# EAGLE design fixture (EAGLE 6.6.0)
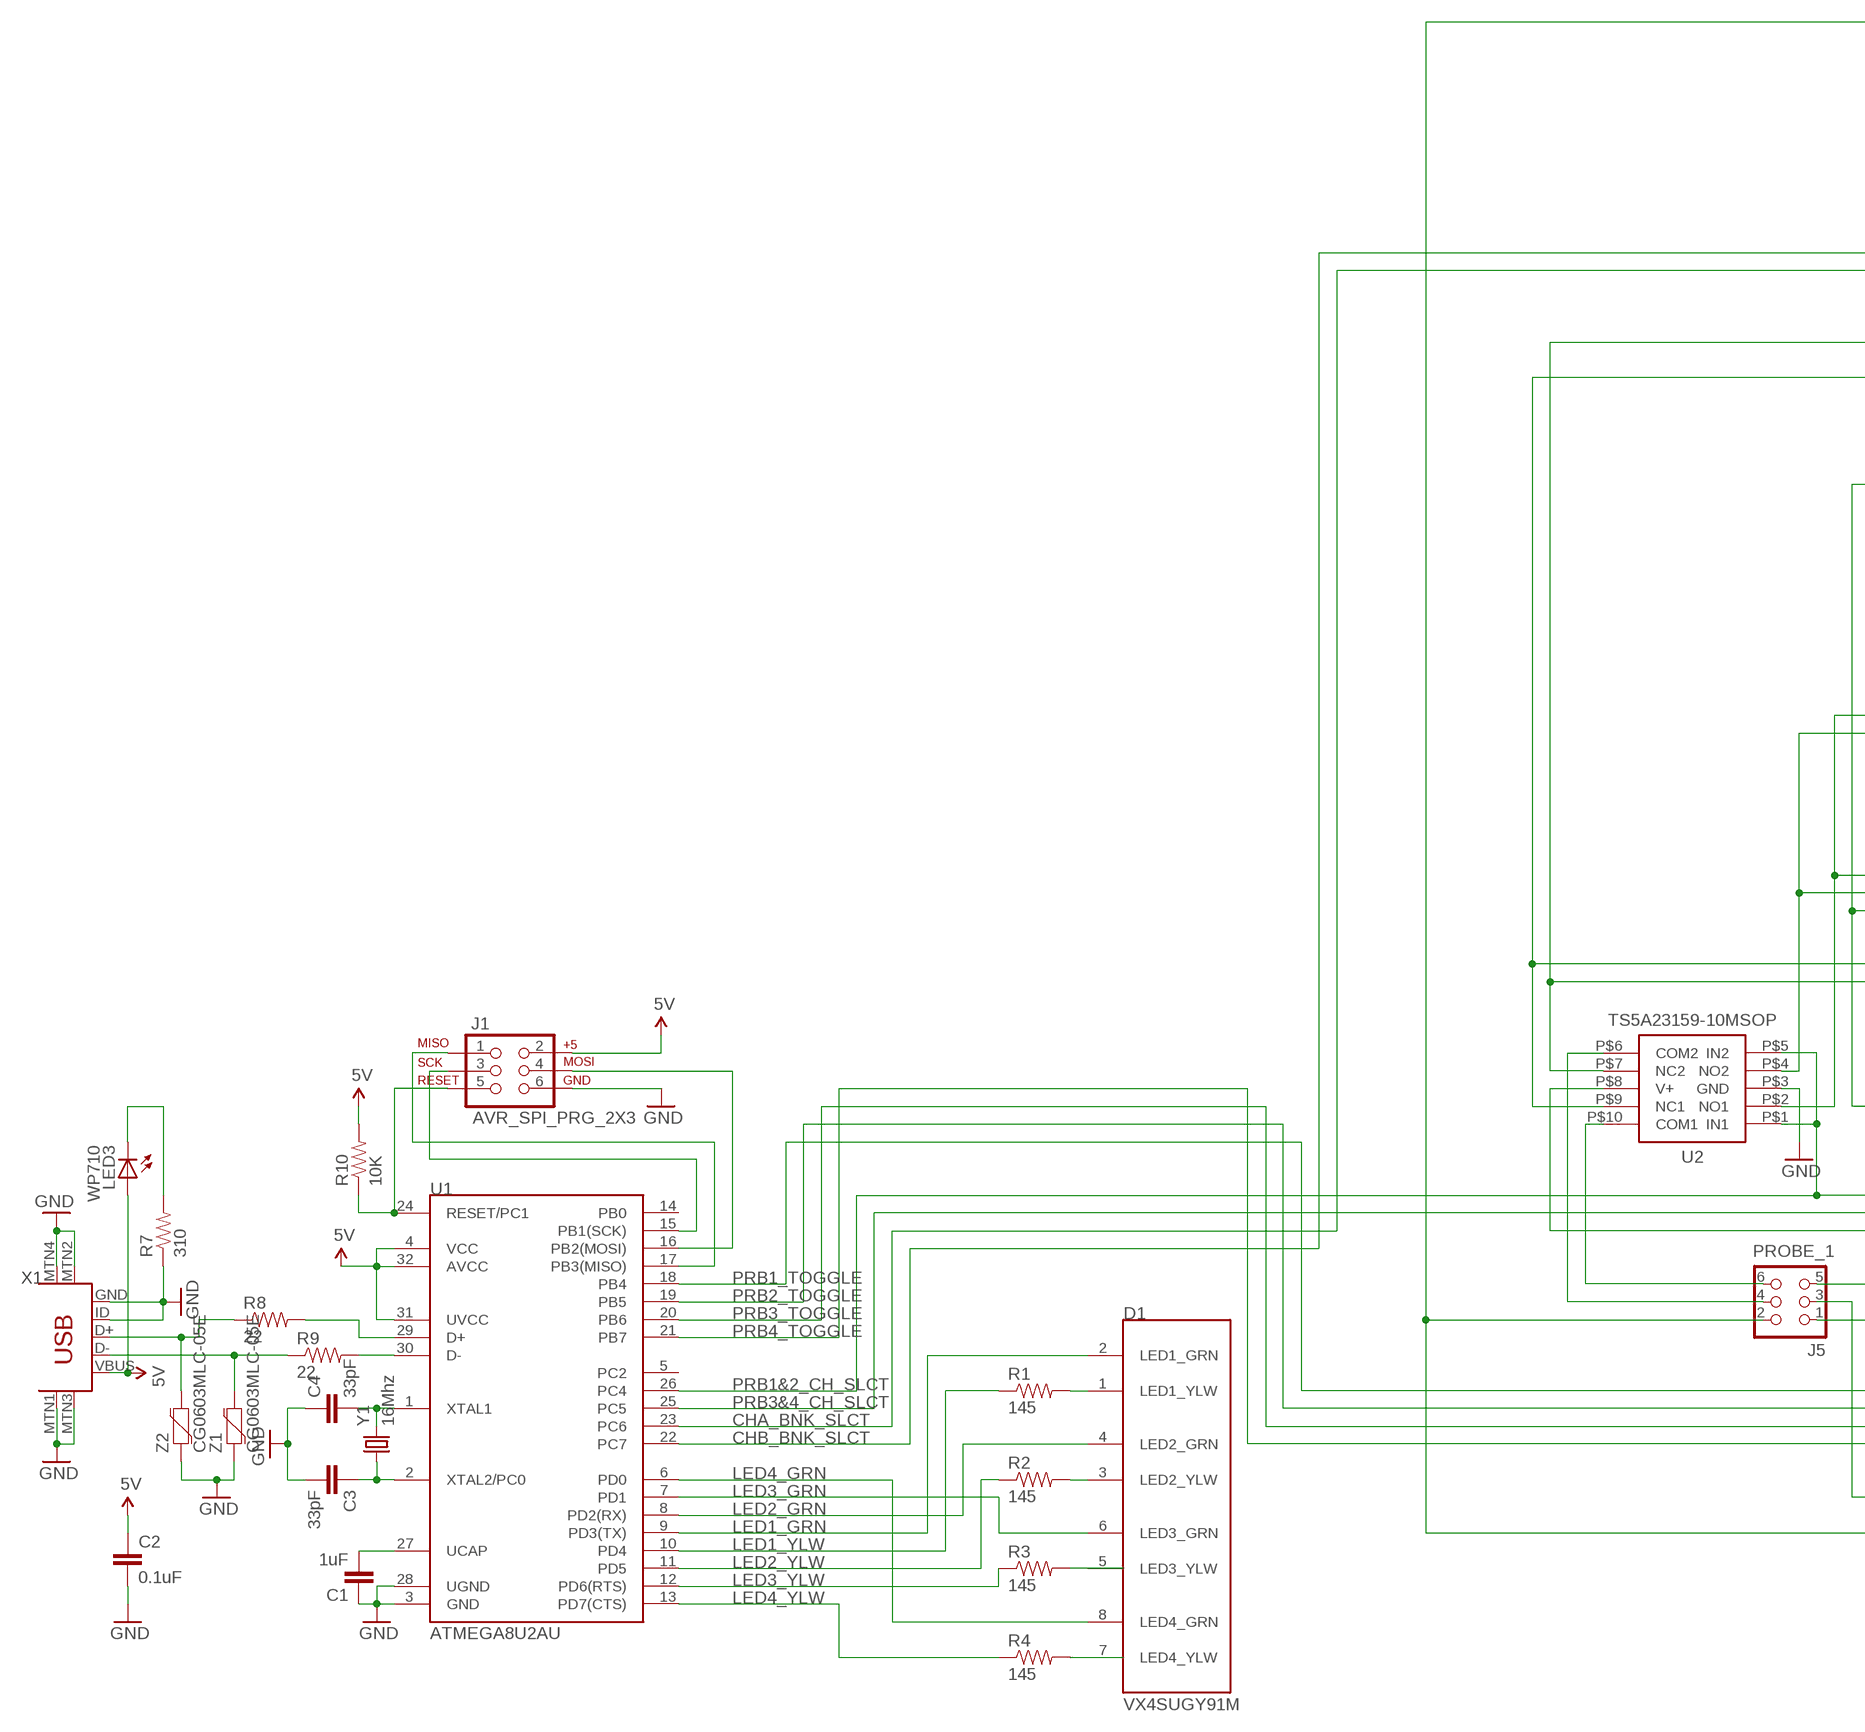
[diagram p0: schematic, sheet 1, part 1 of 2]
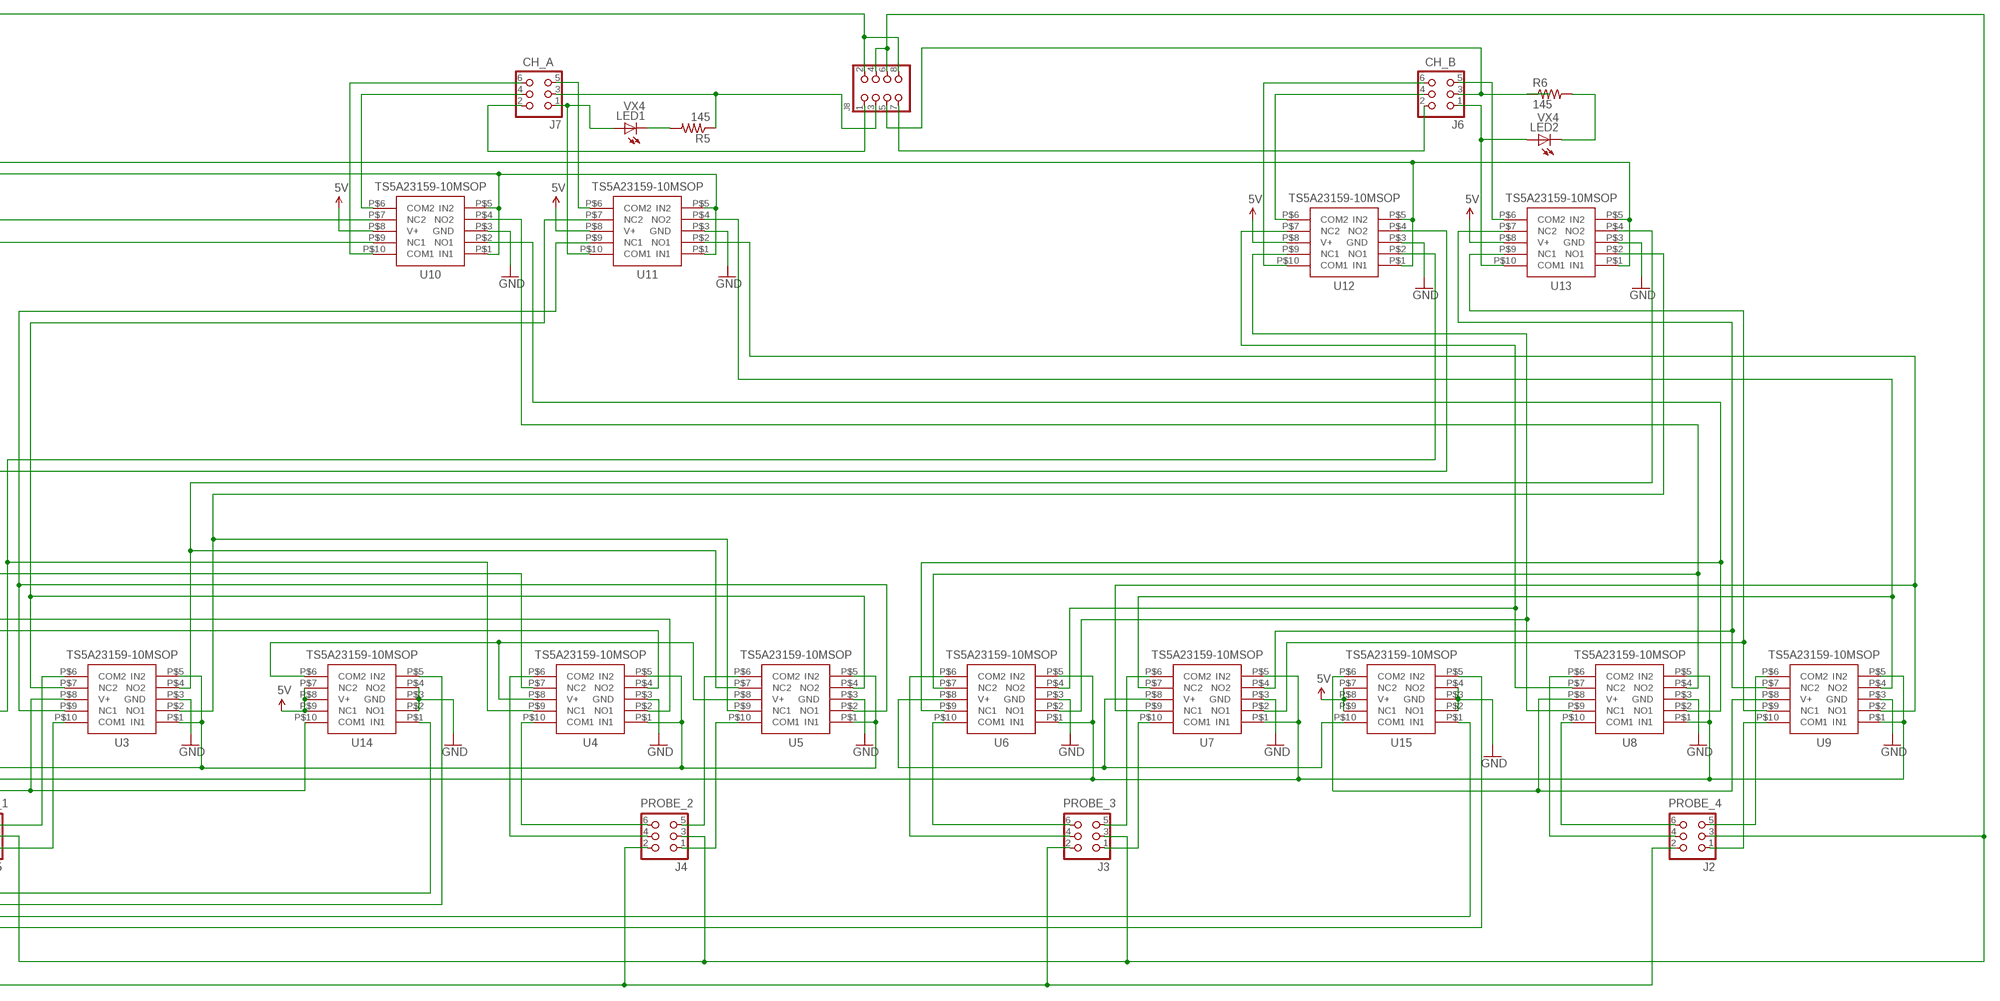
[diagram p1: schematic, sheet 1, part 2 of 2]

## Parts
C1  1uF  1.0UF-16V-10%(0603)  [0603-CAP]
C2  0.1uF  10UF-6.3V-20%(1206)  [1206]
C3  33pF  0.1UF-25V(+80/-20%)(0603)  [0603-CAP]
C4  33pF  0.1UF-25V(+80/-20%)(0603)  [0603-CAP]
D1  VX4SUGY91M  [THRU_HOLE]
J1  AVR_SPI_PRG_2X3  AVR_SPI_PRG_6PTH  [2X3]
J2  CON_HEADER_2X03-PTH  [M2X3]
J3  CON_HEADER_2X03-PTH  [M2X3]
J4  CON_HEADER_2X03-PTH  [M2X3]
J5  CON_HEADER_2X03-PTH  [M2X3]
J6  CON_HEADER_2X03-PTH  [M2X3]
J7  CON_HEADER_2X03-PTH  [M2X3]
J8  CON_HEADER_2X04-PTH  [M2X4]
LED1  VX4  LED3MM  [LED3MM]
LED2  VX4  LED3MM  [LED3MM]
LED3  WP710  LED3MM  [LED3MM]
R1  145  RESISTOR0603-RES  [0603-RES]
R2  145  RESISTOR0603-RES  [0603-RES]
R3  145  RESISTOR0603-RES  [0603-RES]
R4  145  RESISTOR0603-RES  [0603-RES]
R5  145  RESISTOR0603-RES  [0603-RES]
R6  145  RESISTOR0603-RES  [0603-RES]
R7  310  RESISTOR0603-RES  [0603-RES]
R8  22  RESISTOR0603-RES  [0603-RES]
R9  22  RESISTOR0603-RES  [0603-RES]
R10  10K  RESISTOR0603-RES  [0603-RES]
U1  ATMEGA8U2AU  [TQFP32-08]
U2  TS5A23159-10MSOP  [10MSOP]
U3  TS5A23159-10MSOP  [10MSOP]
U4  TS5A23159-10MSOP  [10MSOP]
U5  TS5A23159-10MSOP  [10MSOP]
U6  TS5A23159-10MSOP  [10MSOP]
U7  TS5A23159-10MSOP  [10MSOP]
U8  TS5A23159-10MSOP  [10MSOP]
U9  TS5A23159-10MSOP  [10MSOP]
U10  TS5A23159-10MSOP  [10MSOP]
U11  TS5A23159-10MSOP  [10MSOP]
U12  TS5A23159-10MSOP  [10MSOP]
U13  TS5A23159-10MSOP  [10MSOP]
U14  TS5A23159-10MSOP  [10MSOP]
U15  TS5A23159-10MSOP  [10MSOP]
X1  USB-MINIB-5PIN  [USB-MINIB]
Y1  16Mhz  CRYSTALHC49US  [HC49US]
Z1  CG0603MLC-05E  VARISTOR-0603  [0603-RES]
Z2  CG0603MLC-05E  VARISTOR-0603  [0603-RES]

## Nets
5V: C2.1 J1.2 LED3.A R10.2 U1.4(VCC) U1.31(UVCC) U1.32(AVCC) U10.P$8(V+) U11.P$8(V+) U12.P$8(V+) U13.P$8(V+) U14.P$7(NC2) U14.P$8(V+) U14.P$9(NC1) U15.P$7(NC2) U15.P$8(V+) U15.P$9(NC1) X1.VBUS
BOB123: U3.P$2(NO1) U5.P$9(NC1) U13.P$2(NO1)
CH_A_+5CON: J7.1 LED1.A U11.P$10(COM1)
CH_A_BULK: J7.2 J8.1
CH_A_CLOCK: J7.6 U10.P$10(COM1)
CH_A_DATA: J7.5 U11.P$6(COM2)
CH_A_GND: J7.3 J8.3 R5.1
CH_A_INT: J7.4 U10.P$6(COM2)
CH_B_+5CON: J6.1 LED2.A U13.P$10(COM1)
CH_B_BULK: J6.2 J8.7
CH_B_CLOCK: J6.6 U12.P$10(COM1)
CH_B_DATA: J6.5 U13.P$6(COM2)
CH_B_GND: J6.3 J8.5 R6.1
CH_B_INT: J6.4 U12.P$6(COM2)
CHA_BNK_SLCT: U1.23(PC6) U10.P$1(IN1) U10.P$5(IN2) U11.P$1(IN1) U11.P$5(IN2)
CHB_BNK_SLCT: U1.22(PC7) U12.P$1(IN1) U12.P$5(IN2) U13.P$1(IN1) U13.P$5(IN2)
GND: C1.1 C2.2 C3.2 C4.1 J1.6 R7.1 U1.3(GND) U1.28(UGND) U2.P$3(GND) U3.P$3(GND) U4.P$3(GND) U5.P$3(GND) U6.P$3(GND) U7.P$3(GND) U8.P$3(GND) U9.P$3(GND) U10.P$3(GND) U11.P$3(GND) U12.P$3(GND) U13.P$3(GND) U14.P$2(NO1) U14.P$3(GND) U14.P$4(NO2) U15.P$2(NO1) U15.P$3(GND) U15.P$4(NO2) X1.GND X1.ID X1.MTN1(MTN2) X1.MTN2(MTN3) X1.MTN3(MTN1) X1.MTN4 Z1.1 Z2.1
LED1_GRN: D1.2(LED1_GRN) U1.9(PD3(TX))
LED1_YLW: R1.1 U1.10(PD4)
LED2_GRN: D1.4(LED2_GRN) U1.8(PD2(RX))
LED2_YLW: R2.1 U1.11(PD5)
LED3_GRN: D1.6(LED3_GRN) U1.7(PD1)
LED3_YLW: R3.1 U1.12(PD6(RTS))
LED4_GRN: D1.8(LED4_GRN) U1.6(PD0)
LED4_YLW: R4.1 U1.13(PD7(CTS))
MISO: J1.1 U1.17(PB3(MISO))
MOSI: J1.4 U1.16(PB2(MOSI))
N$1: R8.1 X1.D+ Z2.2
N$2: R8.2 U1.29(D+)
N$3: R9.2 U1.30(D-)
N$4: R9.1 X1.D- Z1.2
N$5: C1.2 U1.27(UCAP)
N$6: U8.P$8(V+) U9.P$8(V+) U15.P$6(COM2)
N$7: C4.2 U1.1(XTAL1) Y1.2
N$8: C3.1 U1.2(XTAL2/PC0) Y1.1
N$9: U6.P$8(V+) U7.P$8(V+) U15.P$10(COM1)
N$10: D1.1(LED1_YLW) R1.2
N$11: D1.3(LED2_YLW) R2.2
N$12: D1.5(LED3_YLW) R3.2
N$13: D1.7(LED4_YLW) R4.2
N$14: U4.P$8(V+) U5.P$8(V+) U14.P$6(COM2)
N$48: LED1.K(C) R5.2
N$49: LED2.K(C) R6.2
N$50: U7.P$2(NO1) U9.P$9(NC1) U13.P$9(NC1)
N$51: U7.P$4(NO2) U9.P$7(NC2) U13.P$7(NC2)
N$52: U6.P$2(NO1) U8.P$9(NC1) U12.P$9(NC1)
N$53: U6.P$4(NO2) U8.P$7(NC2) U12.P$7(NC2)
N$54: U7.P$9(NC1) U9.P$2(NO1) U11.P$2(NO1)
N$55: U7.P$7(NC2) U9.P$4(NO2) U11.P$4(NO2)
N$56: U6.P$9(NC1) U8.P$2(NO1) U10.P$2(NO1)
N$57: U6.P$7(NC2) U8.P$4(NO2) U10.P$4(NO2)
N$58: U3.P$9(NC1) U5.P$2(NO1) U11.P$9(NC1)
N$59: U3.P$7(NC2) U5.P$4(NO2) U11.P$7(NC2)
N$60: U2.P$9(NC1) U4.P$2(NO1) U10.P$9(NC1)
N$61: U2.P$7(NC2) U4.P$4(NO2) U10.P$7(NC2)
N$62: U2.P$4(NO2) U4.P$7(NC2) U12.P$4(NO2)
N$63: U2.P$2(NO1) U4.P$9(NC1) U12.P$2(NO1)
N$64: U3.P$4(NO2) U5.P$7(NC2) U13.P$4(NO2)
N$65: LED3.K(C) R7.2
PRB1&2_CH_SLCT: U1.26(PC4) U2.P$1(IN1) U2.P$5(IN2) U3.P$1(IN1) U3.P$5(IN2) U4.P$1(IN1) U4.P$5(IN2) U5.P$1(IN1) U5.P$5(IN2)
PRB1_TOGGLE: U1.18(PB4) U14.P$1(IN1)
PRB2_TOGGLE: U1.19(PB5) U14.P$5(IN2)
PRB3&4_CH_SLCT: U1.25(PC5) U6.P$1(IN1) U6.P$5(IN2) U7.P$1(IN1) U7.P$5(IN2) U8.P$1(IN1) U8.P$5(IN2) U9.P$1(IN1) U9.P$5(IN2)
PRB3_TOGGLE: U1.20(PB6) U15.P$1(IN1)
PRB4_TOGGLE: U1.21(PB7) U15.P$5(IN2)
PROBE1_+5CON: J5.1 U3.P$10(COM1)
PROBE1_CLOCK: J5.6 U2.P$10(COM1)
PROBE1_DATA: J5.5 U3.P$6(COM2)
PROBE1_INT: J5.4 U2.P$6(COM2)
PROBE1_PWR: U2.P$8(V+) U3.P$8(V+) U14.P$10(COM1)
PROBE2_+5CON: J4.1 U5.P$10(COM1)
PROBE2_CLOCK: J4.6 U4.P$10(COM1)
PROBE2_DATA: J4.5 U5.P$6(COM2)
PROBE2_INT: J4.4 U4.P$6(COM2)
PROBE3_+5CON: J3.1 U7.P$10(COM1)
PROBE3_CLOCK: J3.6 U6.P$10(COM1)
PROBE3_DATA: J3.5 U7.P$6(COM2)
PROBE3_INT: J3.4 U6.P$6(COM2)
PROBE4_+5CON: J2.1 U9.P$10(COM1)
PROBE4_CLOCK: J2.6 U8.P$10(COM1)
PROBE4_DATA: J2.5 U9.P$6(COM2)
PROBE4_INT: J2.4 U8.P$6(COM2)
RESET: J1.5 R10.1 U1.24(RESET/PC1)
SCK: J1.3 U1.15(PB1(SCK))
SCOPE_BULK: J2.2 J3.2 J4.2 J5.2 J8.2 J8.8
SCOPE_GND: J2.3 J3.3 J4.3 J5.3 J8.4 J8.6
Unconnected: U1.5(PC2) U1.14(PB0)

## Notes on the sheet
- CH_A | CH_B
- PROBE_1 | PROBE_2 | PROBE_3 | PROBE_4
- X1

## Library data of the parts
C1 = SparkFun-Capacitors:1.0UF-16V-10%(0603): CAP-00868; PROD_ID: CAP-00868; VALUE: 1.0uF
C2 = SparkFun-Capacitors:10UF-6.3V-20%(1206): CAP-10057 Ceramic; PROD_ID: CAP-10057; VALUE: 10uF
C3 C4 = SparkFun-Capacitors:0.1UF-25V(+80/-20%)(0603): CAP-00810 Ceramic Standard decoupling cap; PROD_ID: CAP-00810; VALUE: 0.1uF
D1 = VX4SUGY91M:VX4SUGY91M: SunLED VX4SUGY91M 2X3mm QUAD-LEVEL LED INDICATOR Green/Yellow bicolor quad LED. Black pastic 8 pin through hole right angle. Pins are active high! datasheet: http://www.jameco.com/Jameco/Products/ProdDS/2125464.pdf
J1 = SparkFun-Connectors:AVR_SPI_PRG_6: AVR ISP 6 Pin This is the reduced ISP connector for AVR programming. Common on Arduino. This footprint will take up less PCB space and can be used with a 10-pin to 6-pin adapter such as SKU: BOB-08508
J2-J7 = 0_DangerousPrototypes:CON_HEADER_2X03
J8 = 0_DangerousPrototypes:CON_HEADER_2X04
LED1-LED3 = led:LED: LED OSRAM: - CHIPLED LG R971, LG N971, LY N971, LG Q971, LY Q971, LO R971, LY R971 LH N974, LH R974 LS Q976, LO Q976, LY Q976 LO Q996 - Hyper CHIPLED LW Q18S LB Q993, LB Q99A, LB R99A - SideLED LS A670, LO A670, LY A670, LG A670, LP A670 LB A673, LV A673, LT A673, LW A673 LH A674 LY A675 LS A676, LA A676, LO A676, LY A676, LW A676 LS A679, LY A679, LG A679 - Hyper Micro SIDELED® LS Y876, LA Y876, LO Y876, LY Y876 LT Y87S - SmartLED LW L88C, LW L88S LB L89C, LB L89S, LG L890 LS L89K, LO L89K, LY L89K LS L896, LA L896, LO L896, LY L896 - TOPLED LS T670, LO T670, LY T670, LG T670, LP T670 LSG T670, LSP T670, LSY T670, LOP T670, LYG T670 LG T671, LOG T671, LSG T671 LB T673, LV T673, LT T673, LW T673 LH T674 LS T676, LA T676, LO T676, LY T676, LB T676, LH T676, LSB T676, LW T676 LB T67C, LV T67C, LT T67C, LS T67K, LO T67K, LY T67K, LW E67C LS E67B, LA E67B, LO E67B, LY E67B, LB E67C, LV E67C, LT E67C LW T67C LS T679, LY T679, LG T679 LS T770, LO T770, LY T770, LG T770, LP T770 LB T773, LV T773, LT T773, LW T773 LH T774 LS E675, LA E675, LY E675, LS T675 LS T776, LA T776, LO T776, LY T776, LB T776 LHGB T686 LT T68C, LB T68C - Hyper Mini TOPLED® LB M676 - Mini TOPLED Santana® LG M470 LS M47K, LO M47K, LY M47K Source: http://www.osram.convergy.de LUXEON: - LUMILED® LXK2-PW12-R00, LXK2-PW12-S00, LXK2-PW14-U00, LXK2-PW14-V00 LXK2-PM12-R00, LXK2-PM12-S00, LXK2-PM14-U00 LXK2-PE12-Q00, LXK2-PE12-R00, LXK2-PE12-S00, LXK2-PE14-T00, LXK2-PE14-U00 LXK2-PB12-K00, LXK2-PB12-L00, LXK2-PB12-M00, LXK2-PB14-N00, LXK2-PB14-P00, LXK2-PB14-Q00 LXK2-PR12-L00, LXK2-PR12-M00, LXK2-PR14-Q00, LXK2-PR14-R00 LXK2-PD12-Q00, LXK2-PD12-R00, LXK2-PD12-S00 LXK2-PH12-R00, LXK2-PH12-S00 LXK2-PL12-P00, LXK2-PL12-Q00, LXK2-PL12-R00 Source: www.luxeon.com KINGBRIGHT: KA-3528ASYC Source: www.kingbright.com
R1-R10 = SparkFun-Passives:RESISTOR: Resistor Basic schematic elements and footprints for 0603, 1206, and PTH resistors.
U1 = SparkFun-DigitalIC:ATMEGA8U2: Atmel 32-pin 8-bit Microcontroller with 8/16/32K Bystes of ISP Flash and USB Controller. ATmega8U2, ATmega16U2, and ATmega32U2
U2-U15 = TS5A23159:TS5A23159: Texas Instruments TS5A23159 Dual SPDT Analog Switch Datasheet: http://www.ti.com/lit/ds/scds201g/scds201g.pdf
X1 = SparkFun-Connectors:USB-MINIB: Mini-USB "B" connector with 5th pin broken out. Created new symbol breaking out 5th "ID" pin in mini/micro USB connector spec. See: http://en.wikipedia.org/wiki/Mini_usb#Cables. Uses same footprint as 4-pin symbol. Also added pins to connect to mounting / shield pads if required (probably not generally needed as signals aren't shielded once they leave the connector).
Y1 = SparkFun-FreqCtrl:CRYSTAL: Various standard crystals. Proven footprints.
Z1 Z2 = SparkFun-DiscreteSemi:VARISTOR: Varistor Varistor (Variable resistor) is a nonlinear resistive element of the voltage dependence that resistance changes with applied voltage. Varistor is equivalent with Zener diode of two series connection.

## Board
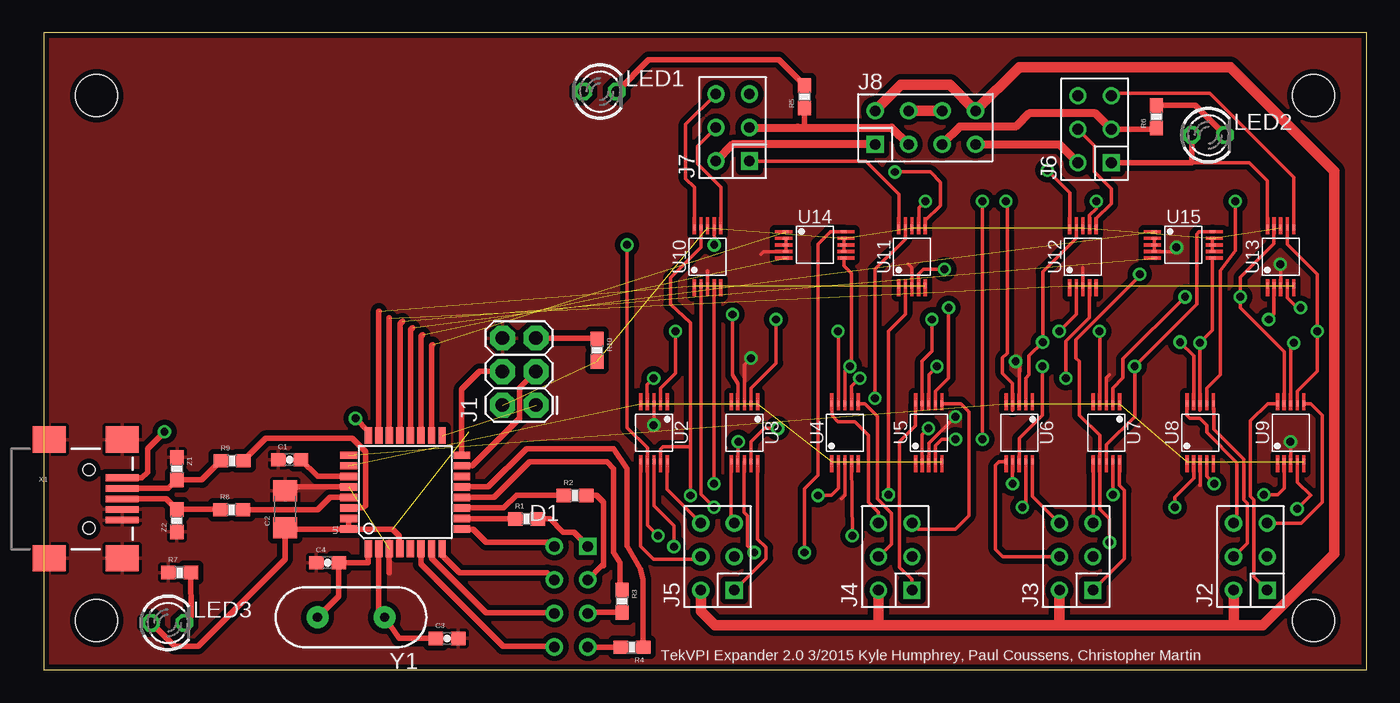
[diagram p2: board, top side]
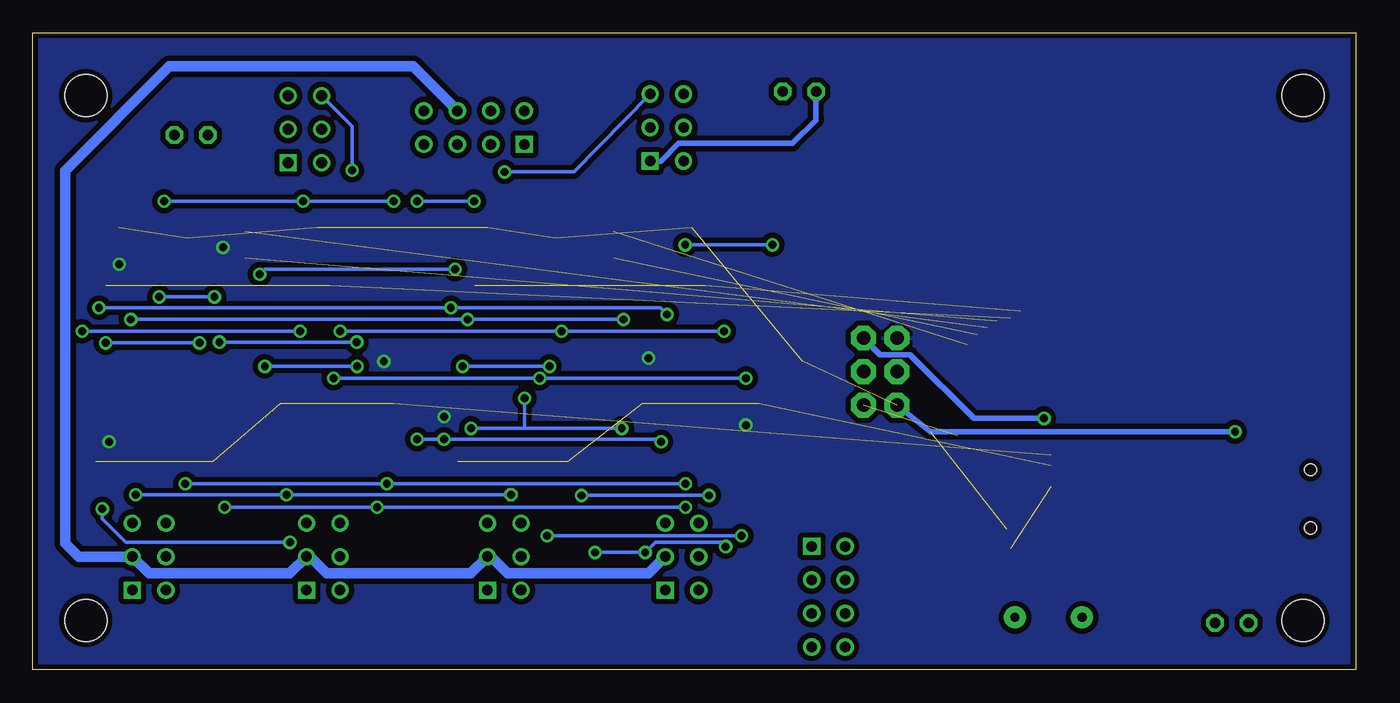
[diagram p3: board, bottom side, seen from below]

Size 100.25 x 48.25 mm. Coordinates in mm from the lower left corner, seen from the top.
Outline: 0,0 100.25,0 100.25,48.25 0,48.25 0,0
Copper layers (1*16): Top 0.035559375mm / dielectric 1.501140625mm / Bottom 0.035559375mm
Design rules "typical_4pcb": minimum track width 10mil, minimum drill 15mil, track to track 6mil, track to pad 6mil, pad to pad 6mil, via to via 6mil, smd to smd 6mil, copper to edge 15mil, drill to drill 8mil, minimum pad ring 10mil, minimum via ring 8mil, stop-mask expansion 4mil, vias tented up to drill 0mil, thermal gap 10mil
Holes 3.2 mm at 4,43.51 4,3.75 96.25,43.51 96.25,3.75

### Footprints (pad centres in the part's own frame; a part is rotated, then mirrored left to right if it is on the bottom)
0603-CAP = smd 1.1 x 1: 1 -0.85,0; 2 0.85,0
1206 = smd 1.6 x 1.8: 1 -1.4,0; 2 1.4,0
THRU_HOLE = drill 0.8 square: 1 1.27,5.08 | drill 0.8: 2 -1.27,5.08; 3 1.27,2.54; 4 -1.27,2.54; 5 1.27,0; 6 -1.27,0; 7 1.27,-2.54; 8 -1.27,-2.54
2X3 = drill 1.016 pad 1.88 octagon: 1 0,0; 2 0,2.54; 3 2.54,0; 4 2.54,2.54; 5 5.08,0; 6 5.08,2.54
M2X3 = drill 0.8 square: 1 -2.54,-1.27 | drill 0.8: 2 -2.54,1.27; 3 0,-1.27; 4 0,1.27; 5 2.54,-1.27; 6 2.54,1.27
M2X4 = drill 0.8 square: 1 -3.81,-1.27 | drill 0.8: 2 -3.81,1.27; 3 -1.27,-1.27; 4 -1.27,1.27; 5 1.27,-1.27; 6 1.27,1.27; 7 3.81,-1.27; 8 3.81,1.27
LED3MM = drill 0.813 octagon: A -1.27,0; K 1.27,0
0603-RES = smd 1.1 x 1: 1 -0.85,0; 2 0.85,0
TQFP32-08 = smd 1.27 x 0.559: 1 -4.293,2.8; 2 -4.293,2; 3 -4.293,1.2; 4 -4.293,0.4; 5 -4.293,-0.4; 6 -4.293,-1.2; 7 -4.293,-2; 8 -4.293,-2.8; 17 4.293,-2.8; 18 4.293,-2; 19 4.293,-1.2; 20 4.293,-0.4; 21 4.293,0.4; 22 4.293,1.2; 23 4.293,2; 24 4.293,2.8 | smd 0.559 x 1.27: 9 -2.8,-4.293; 10 -2,-4.293; 11 -1.2,-4.293; 12 -0.4,-4.293; 13 0.4,-4.293; 14 1.2,-4.293; 15 2,-4.293; 16 2.8,-4.293; 25 2.8,4.293; 26 2,4.293; 27 1.2,4.293; 28 0.4,4.293; 29 -0.4,4.293; 30 -1.2,4.293; 31 -2,4.293; 32 -2.8,4.293
10MSOP = smd 0.406 x 0.203: P$1 -2.2,1; P$2 -2.2,0.5; P$3 -2.2,0; P$4 -2.2,-0.5; P$5 -2.2,-1; P$6 2.2,-1; P$7 2.2,-0.5; P$8 2.2,0; P$9 2.2,0.5; P$10 2.2,1
USB-MINIB = smd 2.5 x 0.5: D+ 2.5,0; D- 2.5,0.8; GND 2.5,-1.6; ID 2.5,-0.8; VBUS 2.5,1.6 | smd 2.5 x 2: MTN1 -3,4.5; MTN2 2.5,4.5; MTN3 -3,-4.5; MTN4 2.5,-4.5 | hole 0.9: 0,2.2; 0,-2.2
HC49US = drill 0.7 pad 1.651: 1 -2.54,0; 2 2.54,0

### Placement (x,y rotation side)
C1  18.62,15.93 0 top
C2  18.29,12.17 90 top
C3  30.57,2.37 0 top
C4  21.5,8.12 0 top
D1  39.96,4.28 0 top
J1  37.31,20.05 90 top
J2  91.46,8.57 90 top
J3  78.25,8.57 90 top
J4  64.53,8.57 90 top
J5  51.07,8.57 90 top
J6  79.64,40.96 90 top
J7  52.21,41.08 90 top
J8  66.82,41.08 0 top
LED1  42.16,43.81 0 top
LED2  88.27,40.51 0 top
LED3  9.4,3.56 0 top
R1  36.58,11.43 0 top
R2  40.26,13.21 0 top
R3  43.81,5.21 270 top
R4  44.58,1.7 180 top
R5  57.66,43.43 90 top
R6  84.33,41.91 90 top
R7  10.29,7.37 0 top
R8  14.23,12.13 0 top
R9  14.26,15.83 0 top
R10  41.92,24.23 270 top
U1  27.39,13.46 90 top
U2  46.24,17.97 270 top
U3  53.1,17.97 270 top
U4  60.72,17.97 90 top
U5  67.07,17.97 90 top
U6  73.93,17.97 270 top
U7  80.53,17.97 270 top
U8  87.65,17.97 90 top
U9  94.5,17.97 90 top
U10  50.31,31.3 90 top
U11  65.8,31.3 90 top
U12  78.76,31.3 90 top
U13  93.74,31.3 90 top
U14  58.44,32.19 0 top
U15  86.38,32.19 0 top
X1  3.43,12.95 0 top
Y1  23.28,3.98 180 top
Z1  10.09,15.25 270 top
Z2  10.09,11.3 90 top

### Tracks (layer width: path | path; a pad name or v marks a point on that pad's centre or on a via)
5V  (via drill 0.6)  (8 unrouted)
  Top 0.254: U15.P$9 U15.P$8 U15.P$7 | U14.P$7 U14.P$8 U14.P$9
  Top 0.406: U1.32 26.42,10.66 26.92,10.16 26.92,9.23 U1.4 | LED3.A 9.91,1.78 11.68,1.78 18.29,8.38 C2.1 19.19,10.66 U1.32 | U1.32 U1.31 | X1.VBUS 7.44,14.55 7.87,14.99 7.87,16.76 v9.14,18.03
  Bottom 0.406: v9.14,18.03 32.24,18.03 J1.2
BOB123  (via drill 0.6)
  Top 0.254: U13.P$2 93.24,26.95 v92.84,26.54 | U5.P$9 66.57,23.39 67.31,24.13 v67.31,26.54 | U3.P$2 53.6,21.34 55.5,23.24 v55.5,26.54
  Bottom 0.254: v92.84,26.54 v67.31,26.54 v55.5,26.54
CH_A_+5CON
  Top 0.254: U11.P$10 64.8,36.04 62.29,38.54 J7.1
  Bottom 0.406: J7.1 52.64,38.54 51.31,39.88 42.67,39.88 40.89,41.66 LED1.A
CH_A_BULK
  Top 0.61: J8.1 52.21,39.81 J7.2
CH_A_CLOCK
  Top 0.254: U10.P$10 49.31,36.54 48.64,37.21 48.64,41.32 J7.6
CH_A_DATA  (via drill 0.6)
  Top 0.254: U11.P$6 66.8,34.04 67.94,35.18 67.94,36.96 67.18,37.72 v64.52,37.72
  Bottom 0.254: v64.52,37.72 59.26,37.72 J7.5
CH_A_GND
  Top 0.406: R5.1 57.66,41.08 57.15,41.08
  Top 0.61: J7.3 57.15,41.08 64.26,41.08 J8.3
CH_A_INT
  Top 0.254: U10.P$6 51.31,36.58 49.53,38.35 49.53,39.67 J7.4
CH_B_+5CON
  Top 0.254: U13.P$10 92.74,37.05 91.38,38.42 87,38.42
  Top 0.406: J6.1 87,38.42 LED2.A
CH_B_BULK
  Top 0.61: J8.7 76.98,39.81 J6.2
CH_B_CLOCK  (via drill 0.6)
  Top 0.254: U12.P$10 77.76,36.16 v76.07,37.85
  Bottom 0.254: v76.07,37.85 76.07,41.2 J6.6
CH_B_DATA
  Top 0.254: U13.P$6 94.74,37.34 88.39,43.69 81.11,43.69 J6.5
CH_B_GND
  Top 0.406: J6.3 84.22,40.96 R6.1
  Top 0.61: J6.3 79.71,42.16 74.68,42.16 73.66,41.15 69.42,41.15 J8.5
CH_B_INT
  Top 0.254: U12.P$6 79.76,34.16 80.9,35.31 80.9,36.45 79.63,37.72 79.63,39.7 J6.4
CHA_BNK_SLCT  (4 unrouted)
  Top 0.406: U1.23 25.39,27.17 25.4,27.18
CHB_BNK_SLCT  (4 unrouted)
  Top 0.406: U1.22 26.19,26.64 26.16,26.67
GND  (via drill 0.6)  (1 unrouted)
  Top 0.254: U15.P$2 U15.P$3 U15.P$4 85.54,31.69 v85.85,32 | U1.3 26.16,9.14 | U14.P$2 U14.P$3 U14.P$4 54.55,31.69 54.36,31.5 | U2.P$3 46.24,18.56 v46.23,18.54 | U3.P$3 53.1,23.13 v53.59,23.62 | U10.P$3 50.31,30.21 50.29,30.23 | U4.P$3 60.72,13.22 60.45,12.95 | U5.P$3 67.07,17.16 v69.09,19.18 | U6.P$3 73.93,23.1 v73.66,23.37 | U11.P$3 65.8,30.46 65.53,30.73 | U12.P$3 78.76,30.46 78.74,30.48 | U13.P$3 93.74,30.72 v93.73,30.73 | U9.P$3 94.5,17.26 v94.49,17.27 | U8.P$3 87.65,13.97 87.63,13.97 | U7.P$3 80.53,22.11 80.77,22.35
  Top 0.406: 26.16,9.14 26.16,7.37 | U1.28 18.58,13.86 arc90 C2.2
  Bottom 0.254: v46.23,18.54 46.35,18.67 | v53.59,23.62 53.85,23.62 | v69.09,19.18 69.09,19.05 | v73.66,23.37 73.6,23.43 | v85.85,32 85.85,32.26 | v93.73,30.73 93.73,30.99 | v94.49,17.27 94.49,17.53
  pour Top (isolate 0.406): 0,48.26 100.33,48.26 100.33,0 0,0
  pour Bottom (isolate 0.406): 0,48.26 100.33,48.26 100.33,0 0,0
LED1_GRN
  Top 0.406: U1.9 32.52,10.66 33.53,9.65 38.4,9.65 D1.2
LED1_YLW
  Top 0.406: U1.10 35.19,11.46 R1.1
LED2_GRN
  Top 0.406: U1.8 30.19,8.67 31.5,7.37 38.15,7.37 D1.4
LED2_YLW
  Top 0.406: U1.11 34.87,12.26 35.81,13.21 R2.1
LED3_GRN
  Top 0.406: U1.7 29.39,8.46 33.53,4.32 38.65,4.32 D1.6
LED3_YLW
  Top 0.406: U1.12 34.14,13.06 36.83,15.75 42.67,15.75 43.18,15.24 43.18,8.89 43.69,8.13 43.69,6.18 R3.1
LED4_GRN
  Top 0.406: U1.6 28.59,7.99 34.8,1.78 38.65,1.78 D1.8
LED4_YLW
  Top 0.406: U1.13 33.67,13.86 36.58,16.76 43.18,16.76 44.2,15.24 44.2,9.4 45.21,7.62 45.43,6.82 R4.1
MISO  (1 unrouted)
MOSI
  Top 0.406: U1.16 31.68,21.27 33.02,22.61 34.75,22.61 J1.4
N$1
  Top 0.406: X1.D+ 9.29,12.95 Z2.2 12.9,12.15 R8.1
N$2
  Top 0.406: R8.2 20.76,12.13 21.7,13.06 U1.29
N$3
  Top 0.406: U1.30 24.2,12.26 24.38,12.45 24.38,16.51 23.37,17.53 16.8,17.53 R9.2
N$4
  Top 0.406: X1.D- 9.45,13.75 Z1.2 11.98,14.4 R9.1
N$5
  Top 0.406: U1.27 20.74,14.66 C1.2
N$6  (via drill 0.6)
  Top 0.254: U15.P$6 88.58,25.71 v87.63,24.77 87.63,19.68 U8.P$8 | U9.P$8 94.5,24.53 v94.74,24.77
  Bottom 0.254: v94.74,24.77 v87.63,24.77
N$7
  Top 0.406: U1.1 24.59,8.12 C4.2 22.35,5.58 Y1.2
N$8
  Top 0.406: U1.2 25.39,3.98 Y1.1 26.92,2.37 C3.1
N$9  (via drill 0.6)
  Top 0.254: U6.P$8 73.93,17.54 75.69,19.3 v75.69,22.99 | U7.P$8 80.53,17.03 82.68,19.18 v82.68,22.99 87.38,27.69 87.38,33.02 87.55,33.19 U15.P$10
  Bottom 0.254: v75.69,22.99 v82.68,22.99
N$10
  Top 0.406: R1.2 38.35,11.43 39.37,10.41 40.18,10.41 D1.1
N$11
  Top 0.406: R2.2 41.91,13.21 42.42,12.7 42.42,7.87 42.29,7.87 D1.3
N$12
  Top 0.406: R3.2 41.31,4.36 D1.5
N$13
  Top 0.406: R4.2 41.27,1.7 D1.7
N$14  (via drill 0.6)
  Top 0.254: U14.P$6 60.64,30.61 61.21,30.04 61.21,23.1 v61.1,22.99 60.72,22.61 U4.P$8 | U5.P$8 67.07,22.37 v67.69,22.99
  Bottom 0.254: v67.69,22.99 v61.1,22.99
N$48
  Top 0.406: R5.2 55.71,46.23 45.85,46.23 LED1.K
N$49
  Top 0.406: R6.2 87.29,42.76 LED2.K
N$50  (via drill 0.6)
  Top 0.254: U13.P$9 93.24,32.28 90.69,29.73 v90.69,28.26 90.69,27.42 94,24.11 U9.P$9 | U7.P$2 81.03,21.34 81.8,22.11 81.8,23.56 v86.5,28.26
  Bottom 0.254: v90.69,28.26 v86.5,28.26
N$51  (via drill 0.6)
  Top 0.254: U13.P$7 94.24,32.25 96.52,29.97 v96.52,25.65 96.52,22.61 95,21.09 U9.P$7 | v80.01,25.65 80.03,25.38 U7.P$4
  Bottom 0.254: v96.52,25.65 v80.01,25.65
N$52  (via drill 0.6)
  Top 0.254: U8.P$9 87.15,23.8 v86.12,24.83 | U12.P$9 78.26,32.71 75.71,30.16 v75.71,24.83 74.68,23.8 74.68,22.35 74.43,22.11 U6.P$2
  Bottom 0.254: v75.71,24.83 v86.12,24.83
N$53  (via drill 0.6)
  Top 0.254: U6.P$4 73.42,19.67 73.42,21.7 72.66,22.46 72.66,23.64 73.03,24 73.03,35.38 v72.91,35.5 | v79.77,35.5 79.77,34.94 79.26,34.42 U12.P$7 | v90.31,35.5 90.31,31.77 89.15,30.23 89.15,22.35 88.15,21.34 U8.P$7
  Bottom 0.254: v72.91,35.5 v79.77,35.5 v90.31,35.5
N$54  (via drill 0.6)
  Top 0.254: U7.P$9 v81.03,13.28 arc90 v81.04,13.27 | U9.P$2 94,13.74 93.53,13.27 v92.47,13.27 | v92.47,13.27 | v64.02,13.27 64.02,25.67 65.3,26.95 U11.P$2
  Bottom 0.254: v92.47,13.27 v81.04,13.27 v64.02,13.27
N$55  (via drill 0.6)
  Top 0.254: U9.P$4 95,14.22 96.01,13.21 v95,12.19 | v80.77,9.65 80.77,11.43 80.03,12.17 U7.P$7 80.03,17.76 78.49,19.3 78.49,23.37 78.23,23.62 78.23,25.02 83.06,29.84 v83.06,29.97 | v68.26,30.35 66.67,30.35 66.3,29.98 U11.P$4
  Bottom 0.254: v95,12.19 95,11.43 93.22,9.65 v80.77,9.65 | v83.06,29.97 82.68,30.35 v68.26,30.35
N$56  (via drill 0.6)
  Top 0.254: U10.P$2 49.81,13.31 v50.8,12.32 | v74.17,12.32 74.43,12.58 U6.P$9 | U8.P$2 87.15,14.5 85.72,13.08 v85.72,12.32
  Bottom 0.254: v50.8,12.32 v74.17,12.32 v85.72,12.32
N$57  (via drill 0.6)
  Top 0.254: v73.43,14.1 U6.P$7 | U10.P$4 v50.8,14.1 | U8.P$4 88.15,14.66 v88.71,14.1
  Bottom 0.254: v50.8,14.1 v73.43,14.1 v88.71,14.1
N$58  (via drill 0.6)
  Top 0.254: U11.P$9 65.29,33.12 65.29,32.64 62.99,30.34 v62.99,20.57 | U5.P$2 66.57,17.8 v67.06,18.29 | U3.P$9 53.6,17.01 53.59,17.02 53.59,17.27 54.61,18.29 v55.63,18.29
  Bottom 0.254: v55.63,18.29 62.99,18.29 | 62.99,18.29 v67.06,18.29 | v62.99,20.57 62.99,18.29
N$59  (via drill 0.6)
  Top 0.254: U5.P$4 67.57,16.96 68.07,17.46 v69.1,17.46 | v71.14,17.46 v71.14,35.5 | v66.82,35.5 66.31,35.02 U11.P$7 | v52.64,17.27 52.6,17.23 U3.P$7
  Bottom 0.254: v71.14,17.46 v69.1,17.46 52.83,17.46 v52.64,17.27 | v71.14,35.5 v66.82,35.5
N$60  (via drill 0.6)
  Top 0.254: U10.P$9 49.81,32.03 47.5,29.72 47.5,27.69 49.02,26.29 49.02,16.89 | 49.02,16.89 v49.02,13.21 | U2.P$9 46.74,16.71 46.93,16.89 49.02,16.89 | U4.P$2 60.22,13.74 59.69,13.21 v58.67,13.21
  Bottom 0.254: v58.67,13.21 v49.02,13.21
N$61  (via drill 0.6)
  Top 0.254: U10.P$7 50.82,32.23 v50.82,32.19 | v44.21,32.19 44.21,18.35 45.74,16.82 U2.P$7 45.74,10.96 v46.55,10.16 | v61.28,10.16 U4.P$4
  Bottom 0.254: v44.21,32.19 v50.82,32.19 | v46.55,10.16 v61.28,10.16
N$62  (via drill 0.6)
  Top 0.254: U12.P$4 79.26,26.68 77.47,24.89 v77.47,22.1 | v61.85,22.1 61.22,21.47 U4.P$7 | U2.P$4 45.72,20.19 45.72,21.59 v46.23,22.1
  Bottom 0.254: v77.47,22.1 v61.85,22.1 v46.23,22.1
N$63  (via drill 0.6)
  Top 0.254: U12.P$2 78.26,26.95 v76.96,25.65 | U4.P$9 60.22,25.63 v60.2,25.65 | v47.88,25.65 47.88,22.48 46.74,21.34 U2.P$2
  Bottom 0.254: v76.96,25.65 v60.2,25.65 v47.88,25.65
N$64  (via drill 0.6)
  Top 0.254: v68.58,27.43 68.58,22.1 67.57,21.09 U5.P$7 | U3.P$4 52.6,21.69 52.2,22.35 v52.2,26.92 | v95.25,27.43 95,27.43 94.24,28.19 U13.P$4
  Bottom 0.254: v95.25,27.43 v68.58,27.43 52.7,27.43 v52.2,26.92
N$65
  Top 0.406: R7.2 11.18,4.06 LED3.K
PRB1&2_CH_SLCT  (8 unrouted)
PRB1_TOGGLE  (1 unrouted)
  Top 0.406: U1.18 29.39,24.56 29.46,24.64
PRB2_TOGGLE  (1 unrouted)
  Top 0.406: U1.19 28.59,25.29 28.7,25.4
PRB3&4_CH_SLCT  (8 unrouted)
PRB3_TOGGLE  (1 unrouted)
  Top 0.406: U1.20 27.79,25.76 27.94,25.91
PRB4_TOGGLE  (1 unrouted)
  Top 0.406: U1.21 26.99,26.23 27.18,26.42
PROBE1_+5CON
  Top 0.254: J5.1 54.74,8.43 54.74,9.27 54.1,9.91 U3.P$10
PROBE1_CLOCK
  Top 0.254: U2.P$10 47.24,13.67 J5.6
PROBE1_DATA
  Top 0.254: U3.P$6 52.1,11.35 J5.5
PROBE1_INT
  Top 0.254: U2.P$6 45.24,9.37 46.23,8.38 49.61,8.38 J5.4
PROBE1_PWR  (via drill 0.6)
  Top 0.254: U14.P$10 59.61,33.19 58.67,32.26 58.67,14.73 57.66,13.72 v57.66,8.89 | v53.85,8.89 53.34,9.4 53.34,11.68 53.09,11.94 53.09,15.75 U3.P$8 | U2.P$8 46.24,12.43 47.75,10.92 v47.75,9.34
  Bottom 0.254: v57.66,8.89 v53.85,8.89 53.09,9.65 48.07,9.65 v47.75,9.34
PROBE2_+5CON
  Top 0.254: J4.1 65.8,6.87 64.86,7.79 64.86,17.28 66.06,18.48 66.06,19.9 U5.P$10
PROBE2_CLOCK
  Top 0.254: J4.6 63.26,11.92 62.48,12.7 62.48,17.78 61.47,18.8 60.2,18.8 59.72,19.27 U4.P$10
PROBE2_DATA
  Top 0.254: 68.07,20.07 U5.P$6 69.49,20.17 70.1,19.56 70.1,11.68 69.09,10.67 66.25,10.67 J4.5 65.87,11.11
PROBE2_INT
  Top 0.254: J4.4 64.24,9.52 64.26,9.55 64.26,11.87 63.18,12.95 63.18,19.22 62.25,20.15 U4.P$6
PROBE3_+5CON
  Top 0.254: J3.1 81.92,8.43 81.92,13.59 81.53,13.97 U7.P$10
PROBE3_CLOCK
  Top 0.254: U6.P$10 74.93,13.16 J3.6
PROBE3_DATA
  Top 0.254: U7.P$6 79.53,11.13 J3.5
PROBE3_INT
  Top 0.254: J3.4 72.71,8.57 72.14,9.14 72.14,15.49 72.39,15.75 72.91,15.75 U6.P$6
PROBE4_+5CON
  Top 0.254: J2.1 91.71,7.05 91.71,12.89 91.46,13.14 91.46,18.86 92.77,20.17 U9.P$10
PROBE4_CLOCK
  Top 0.254: J2.6 90.42,11.35 90.42,15.7 88.14,17.99 88.14,18.54 87.63,19.05 86.87,19.05 86.65,19.27 U8.P$10
PROBE4_DATA
  Top 0.254: J2.5 95.31,11.11 96.9,12.7 96.9,19.3 96.03,20.17 U9.P$6
PROBE4_INT
  Top 0.254: J2.4 91.2,9.59 91.2,12.64 90.95,12.89 90.95,15.94 88.66,18.22 88.66,19.65 U8.P$6
RESET  (via drill 0.6)
  Top 0.406: R10.1 41.87,25.13 J1.5 | U1.24 24.59,18.08 v23.62,19.05
  Bottom 0.406: v23.62,19.05 28.96,19.05 33.78,23.88 36.05,23.88 J1.5
SCK
  Top 0.406: U1.15 32.48,15.46 36.07,19.05 36.07,21.36 J1.3
SCOPE_BULK
  Top 0.813: J8.2 64.98,44.32 68.66,44.32 J8.8 73.93,45.66 89.93,45.66 97.81,37.78 97.81,8.79 92.38,3.37 90.19,3.37 | 76.98,3.37 90.17,3.37 90.19,3.37 | 76.98,3.37 63.26,3.37 | 63.26,3.37 50.86,3.37 49.8,4.43 J5.2 | J4.2 63.26,3.37 | J3.2 76.98,3.37 | J2.2 90.19,3.37
SCOPE_GND
  Top 0.813: J8.4 J8.6
  Bottom 0.813: J5.3 53.61,7.3 64.28,7.3 65.55,8.57 J4.3 67.07,7.3 77.99,7.3 79.26,8.57 J3.3 80.79,7.3 91.46,7.3 J2.3 96.79,8.57 97.81,9.59 97.81,37.83 89.92,45.72 71.45,45.72 J8.6

### Text on the board
tNames: TekVPI Expander 2.0 3/2015 Kyle Humphrey, Paul Coussens, Christopher Martin